# EAGLE schematic ProMiniLoRaBreakout_2020-08-24 (EAGLE 9.2.0)
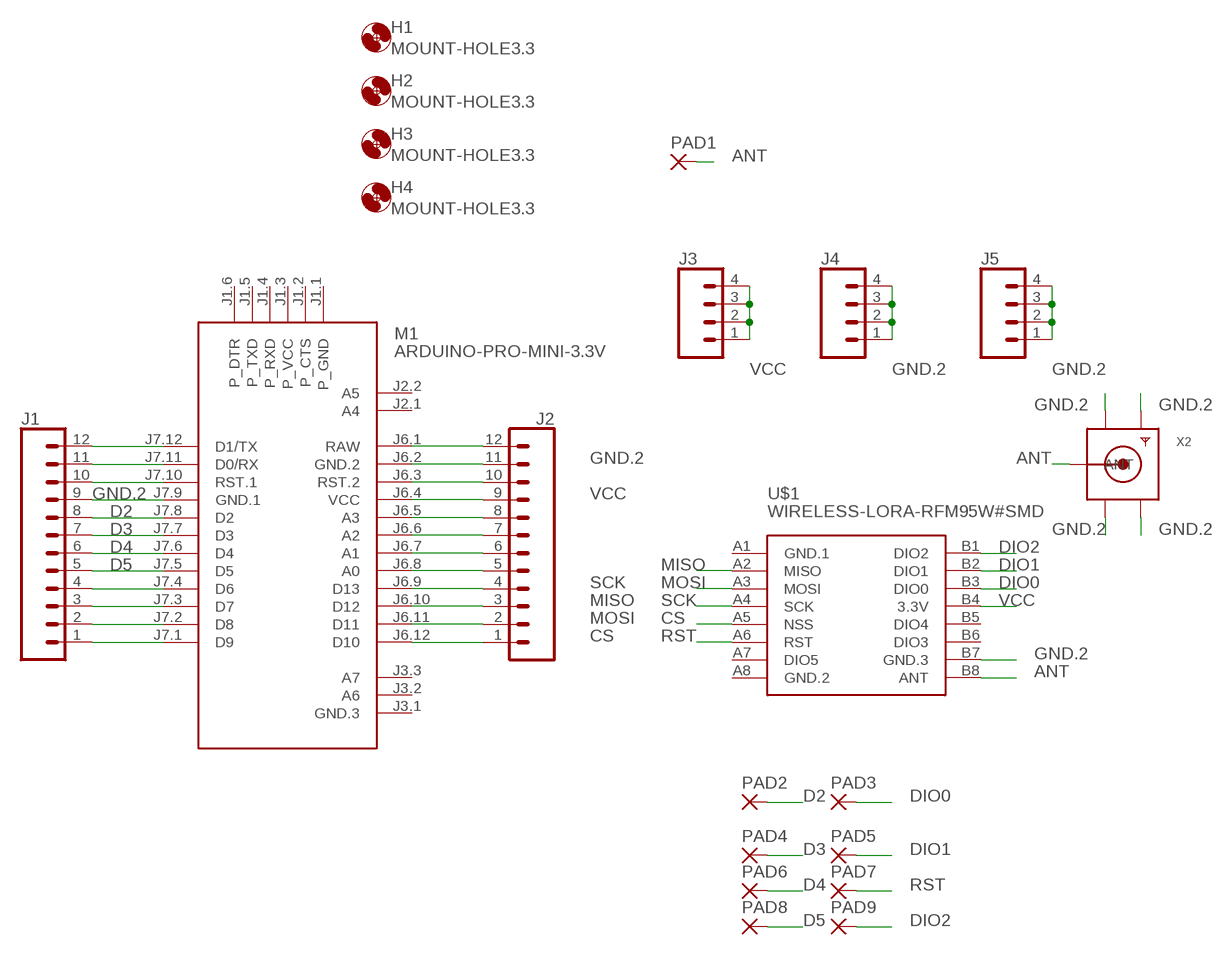
[diagram p0: schematic, sheet 1]

## Parts
H1  MOUNT-HOLE3.3  [3,3]
H2  MOUNT-HOLE3.3  [3,3]
H3  MOUNT-HOLE3.3  [3,3]
H4  MOUNT-HOLE3.3  [3,3]
J1  CONN_12  [1X12]
J2  CONN_12  [1X12]
J3  CONN_04  [1X04]
J4  CONN_04  [1X04]
J5  CONN_04  [1X04]
M1  ARDUINO-PRO-MINI-3.3V  [ARDUINO-PRO-MINI]
PAD1  2,15/1,0  [2,15/1,0]
PAD2  SMD2  [SMD1,27-2,54]
PAD3  SMD2  [SMD1,27-2,54]
PAD4  SMD2  [SMD1,27-2,54]
PAD5  SMD2  [SMD1,27-2,54]
PAD6  SMD2  [SMD1,27-2,54]
PAD7  SMD2  [SMD1,27-2,54]
PAD8  SMD2  [SMD1,27-2,54]
PAD9  SMD2  [SMD1,27-2,54]
U$1  WIRELESS-LORA-RFM95W#SMD  [WIRELESS-LORA-RFM95W#SMD]
X2  SMACONNECTOR_EDGE_UFL  [SMA_EDGELAUNCH_UFL]

## Nets
ANT [antenna]: PAD1.1(P) U$1.B8(ANT) X2.P(ANT)
CS: J2.1 M1.J6.12(D10) U$1.A5(NSS)
D2: J1.8 M1.J7.8(D2) PAD2.1(P)
D3: J1.7 M1.J7.7(D3) PAD4.1(P)
D4: J1.6 M1.J7.6(D4) PAD6.1(P)
D5: J1.5 M1.J7.5(D5) PAD8.1(P)
DIO0: PAD3.1(P) U$1.B3(DIO0)
DIO1: PAD5.1(P) U$1.B2(DIO1)
DIO2: PAD9.1(P) U$1.B1(DIO2)
GND.2: J1.9 J2.11 J4.1 J4.2 J4.3 J4.4 J5.1 J5.2 J5.3 J5.4 M1.J6.2(GND.2) M1.J7.9(GND.1) U$1.B7(GND.3) X2.GND@1(GND1) X2.GND@2(GND2) X2.GND@3(GND3) X2.GND@4(GND4)
MISO: J2.3 M1.J6.10(D12) U$1.A2(MISO)
MOSI: J2.2 M1.J6.11(D11) U$1.A3(MOSI)
N$1: J1.1 M1.J7.1(D9)
N$2: J1.2 M1.J7.2(D8)
N$3: J1.3 M1.J7.3(D7)
N$4: J1.4 M1.J7.4(D6)
N$10: J1.10 M1.J7.10(RST.1)
N$11: J1.11 M1.J7.11(D0/RX)
N$12: J1.12 M1.J7.12(D1/TX)
N$13: J2.6 M1.J6.7(A1)
N$14: J2.7 M1.J6.6(A2)
N$15: J2.8 M1.J6.5(A3)
N$17: J2.5 M1.J6.8(A0)
N$18: J2.10 M1.J6.3(RST.2)
N$20: J2.12 M1.J6.1(RAW)
RST: PAD7.1(P) U$1.A6(RST)
SCK: J2.4 M1.J6.9(D13) U$1.A4(SCK)
VCC [power]: J2.9 J3.1 J3.2 J3.3 J3.4 M1.J6.4(VCC) U$1.B4(3.3V)
Unconnected: M1.J1.1(P_GND) M1.J1.2(P_CTS) M1.J1.3(P_VCC) M1.J1.4(P_RXD) M1.J1.5(P_TXD) M1.J1.6(P_DTR) M1.J2.1(A4) M1.J2.2(A5) M1.J3.1(GND.3) M1.J3.2(A6) M1.J3.3(A7) U$1.A7(DIO5) U$1.B5(DIO4) U$1.B6(DIO3)

## Power pins joined to a net without a drawn wire
GND.1: U$1.A1(GND.1)
GND.2: U$1.A8(GND.2)

## Library data of the parts
H1-H4 = holes:MOUNT-HOLE: MOUNTING HOLE with drill center marker
J1 J2 = SparkFun-Connectors:CONN_12: Multi connection point. Often used as Generic Header-pin footprint for 0.1 inch spaced/style header connections On any of the 0.1 inch spaced packages, you can populate with these: Break Away Headers - Straight <https://www.sparkfun.com/products/116> (PRT-00116) Break Away Male Headers - Right Angle <https://www.sparkfun.com/products/553> (PRT-00553) Female Headers <https://www.sparkfun.com/products/115> (PRT-00115) Break Away Headers - Machine Pin <https://www.sparkfun.com/products/117> (PRT-00117) Break Away Female Headers - Swiss Machine Pin <https://www.sparkfun.com/products/743> (PRT-00743) For SCREWTERMINALS and SPRING TERMINALS visit here: Screw Terimnals on SparkFun.com <https://www.sparkfun.com/search/results?term=Screw+Terminals> (5mm/3.5mm/2.54mm spacing) This device is also useful as a general connection point to wire up your design to another part of your project. Our various solder wires solder well into these plated through hole pads. Hook-Up Wire - Assortment (Stranded, 22 AWG) <https://www.sparkfun.com/products/11375> (PRT-11375) Hook-Up Wire - Assortment (Solid Core, 22 AWG) <https://www.sparkfun.com/products/11367> (PRT-11367) View the entire wire category on our website here <https://www.sparkfun.com/categories/141> Special notes: Molex polarized connector foot print use with SKU : PRT-08231 with associated crimp pins and housings. 1MM SMD Version SKU: PRT-10208 NOTES ON THE VARIANTS LOCK and LOCK_LONGPADS... This footprint was designed to help hold the alignment of a through-hole component (i.e. 6-pin header) while soldering it into place. You may notice that each hole has been shifted either up or down by 0.005 of an inch from it's more standard position (which is a perfectly straight line). This slight alteration caused the pins (the squares in the middle) to touch the edges of the holes. Because they are alternating, it causes a "brace" to hold the component in place. 0.005 has proven to be the perfect amount of "off-center" position when using our standard breakaway headers. Although looks a little odd when you look at the bare footprint, once you have a header in there, the alteration is very hard to notice. Also,if you push a header all the way into place, it is covered up entirely on the bottom side.
J3-J5 = SparkFun-Connectors:CONN_04: Multi connection point. Often used as Generic Header-pin footprint for 0.1 inch spaced/style header connections On any of the 0.1 inch spaced packages, you can populate with these: Break Away Headers - Straight <https://www.sparkfun.com/products/116> (PRT-00116) Break Away Male Headers - Right Angle <https://www.sparkfun.com/products/553> (PRT-00553) Female Headers <https://www.sparkfun.com/products/115> (PRT-00115) Break Away Headers - Machine Pin <https://www.sparkfun.com/products/117> (PRT-00117) Break Away Female Headers - Swiss Machine Pin <https://www.sparkfun.com/products/743> (PRT-00743) For SCREWTERMINALS and SPRING TERMINALS visit here: Screw Terimnals on SparkFun.com <https://www.sparkfun.com/search/results?term=Screw+Terminals> (5mm/3.5mm/2.54mm spacing) This device is also useful as a general connection point to wire up your design to another part of your project. Our various solder wires solder well into these plated through hole pads. Hook-Up Wire - Assortment (Stranded, 22 AWG) <https://www.sparkfun.com/products/11375> (PRT-11375) Hook-Up Wire - Assortment (Solid Core, 22 AWG) <https://www.sparkfun.com/products/11367> (PRT-11367) View the entire wire category on our website here <https://www.sparkfun.com/categories/141> Special notes: Molex polarized connector foot print use with SKU : PRT-08231 with associated crimp pins and housings. 1MM SMD Version SKU: PRT-10208; PROD_ID: CONN-09696
M1 = diy-modules:ARDUINO-PRO-MINI-*: Arduino Pro Mini and compatible devices More details available here: https://www.arduino.cc/en/Main/ArduinoBoardProMini Click here to find device on ebay.com <http://www.ebay.com/sch/arduino+pro+mini>
PAD1 = wirepad:2,15/1,0: THROUGH-HOLE PAD
PAD2-PAD9 = wirepad:SMD2: SMD PAD
U$1 = diy-modules:WIRELESS-LORA-RFM95W: 868/915 MHz LoRa Radio Transceiver Module based on SX1276 chip Click here to find device on ebay.com <http://www.ebay.com/sch/RFM95W+transceiver>
X2 = adafruit:SMACONNECTOR: SMA Connector 90° DIP SMA Connector, 50 Ohm (4UConnector: 07259)

## Net classes
0 default: width 0.305 mm
1 power: width 0.508 mm
2 antenna: width 0.508 mm